# Altium schematic sheet [03] - CPU POWER.SchDoc: CPU POWER
size A4; Organization: Bjørn T. Brodtkorb; Address1: Frode Rinnans veg 161; Address2: 7050 Trondheim; DocumentNumber: 4; Revision: 1.0; SheetNumber: 4; SheetTotal: 13
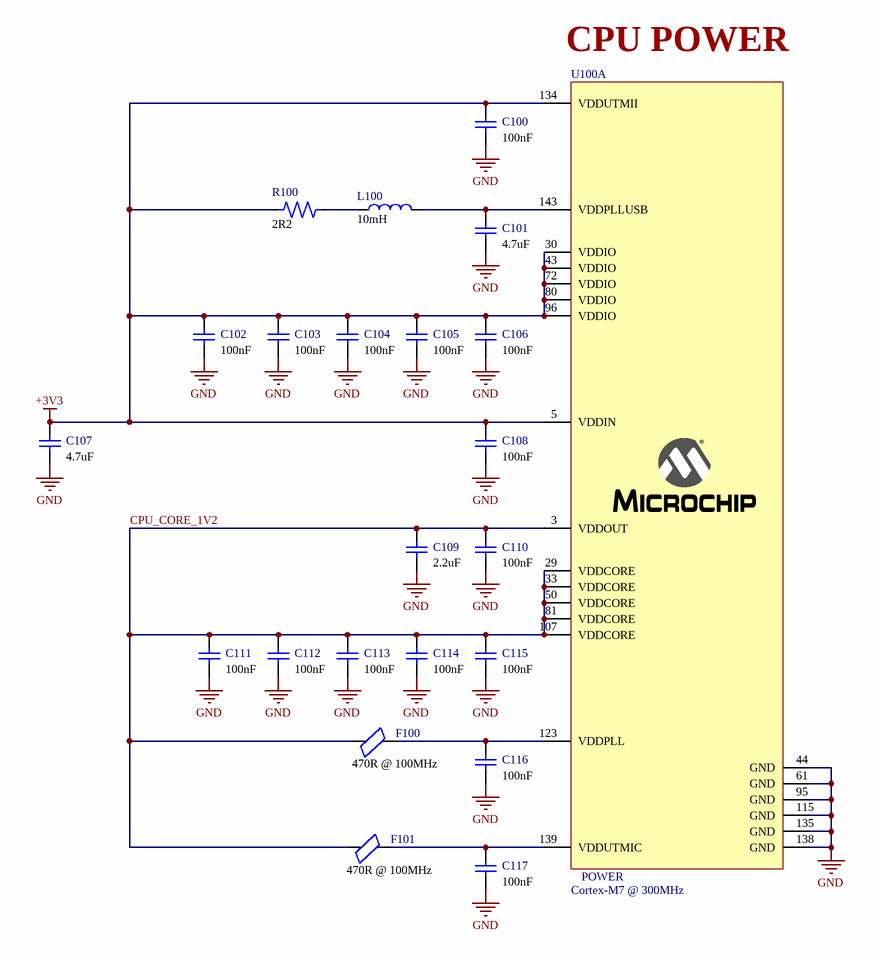
[diagram p0: [03] - CPU POWER.SchDoc]

## Parts
C100  value 100nF  [C0402]  (hidden comment: 04023C103KAT2A)
C101  value 4.7uF  [C0603]  (hidden comment: 02016D104KAT2A)
C102  value 100nF  [C0402]  (hidden comment: 04023C103KAT2A)
C103  value 100nF  [C0402]  (hidden comment: 04023C103KAT2A)
C104  value 100nF  [C0402]  (hidden comment: 04023C103KAT2A)
C105  value 100nF  [C0402]  (hidden comment: 04023C103KAT2A)
C106  value 100nF  [C0402]  (hidden comment: 04023C103KAT2A)
C107  value 4.7uF  [C0603]  (hidden comment: 02016D104KAT2A)
C108  value 100nF  [C0402]  (hidden comment: 04023C103KAT2A)
C109  value 2.2uF  [C0402]  (hidden comment: 04023C103KAT2A)
C110  value 100nF  [C0402]  (hidden comment: 04023C103KAT2A)
C111  value 100nF  [C0402]  (hidden comment: 04023C103KAT2A)
C112  value 100nF  [C0402]  (hidden comment: 04023C103KAT2A)
C113  value 100nF  [C0402]  (hidden comment: 04023C103KAT2A)
C114  value 100nF  [C0402]  (hidden comment: 04023C103KAT2A)
C115  value 100nF  [C0402]  (hidden comment: 04023C103KAT2A)
C116  value 100nF  [C0402]  (hidden comment: 04023C103KAT2A)
C117  value 100nF  [C0402]  (hidden comment: 04023C103KAT2A)
F100  value 470R @ 100MHz  [Ferrite bead 0402]  (hidden comment: BLM15AG102SN1D)
F101  value 470R @ 100MHz  [Ferrite bead 0402]  (hidden comment: BLM15AG102SN1D)
L100  value 10mH  [Inductor 0603]  (hidden comment: MLZ1608A2R2WT)
R100  value 2R2  [R0402]  (hidden comment: CRCW04020000Z0ED)
U100  Cortex-M7 @ 300MHz  [ATSAMS70Q21A-AN]  (part A of 4)

## Nets
+3V3: C100.2 C102.2 C103.2 C104.2 C105.2 C106.2 C107.2 C108.2 R100.1 U100.5(VDDIN) U100.30(VDDIO) U100.43(VDDIO) U100.72(VDDIO) U100.80(VDDIO) U100.96(VDDIO) U100.134(VDDUTMII)
GND: C100.1 C101.1 C102.1 C103.1 C104.1 C105.1 C106.1 C107.1 C108.1 C109.1 C110.1 C111.1 C112.1 C113.1 C114.1 C115.1 C116.1 C117.1 U100.44(GND) U100.61(GND) U100.95(GND) U100.115(GND) U100.135(GND) U100.138(GND)
CPU_CORE_1V2: C109.2 C110.2 C111.2 C112.2 C113.2 C114.2 C115.2 F100.1 F101.1 U100.3(VDDOUT) U100.29(VDDCORE) U100.33(VDDCORE) U100.50(VDDCORE) U100.81(VDDCORE) U100.107(VDDCORE)
NetC101_2: C101.2 L100.2 U100.143(VDDPLLUSB)
NetC116_2: C116.2 F100.2 U100.123(VDDPLL)
NetC117_2: C117.2 F101.2 U100.139(VDDUTMIC)
NetL100_1: L100.1 R100.2

## Notes on the sheet
- (near U100) CPU POWER
- Title
- Size:
- Date:
- A4
- Number:
- Time:
- Revision:
- Sheet
- of
- StrawberryHacker
- File:
- (in symbol ATSAMS70Q21A-AN, part A) POWER

## Library data of the parts
C100 C102-C106 C108-C117 = 04023C103KAT2A: C0402
C101 C107 = 02016D104KAT2A: C0603
F100 F101 = BLM15AG102SN1D: Ferrite bead 0402
L100 = MLZ1608A2R2WT: Inductor 0603
R100 = CRCW04020000Z0ED: R0402
U100 = ATSAMS70Q21A-AN: ATSAMS70Q21; Supplier Part Number 1: 2484397; Supplier 1: Farnell